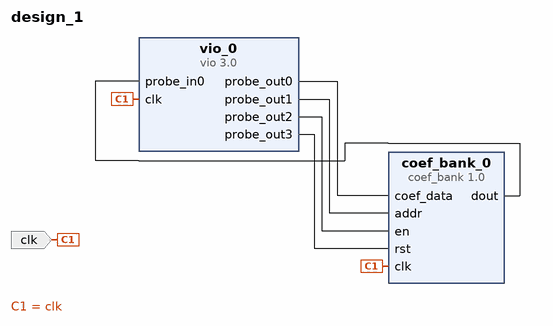
[diagram p0: block diagram of the top level]
# Vivado block design design_1, xc7a35tcpg236-1, Vivado 2019.1
create_bd_design design_1

create_bd_port -dir I -type clk clk
set_property -dict {CONFIG.FREQ_HZ 100000000} [get_bd_ports clk]

create_bd_cell -type ip -vlnv xilinx.com:ip:vio:3.0 vio_0
set_property -dict {CONFIG.C_NUM_PROBE_OUT 4 CONFIG.C_PROBE_OUT0_WIDTH 25 CONFIG.C_PROBE_OUT1_WIDTH 3} [get_bd_cells vio_0]
create_bd_cell -type ip -vlnv xilinx.com:user:coef_bank:1.0 coef_bank_0
set_property -dict {CONFIG.log2_nbr_coef 3 CONFIG.nbr_coef 8} [get_bd_cells coef_bank_0]

# ---- connections ----

connect_bd_net [get_bd_pins vio_0/probe_out0] [get_bd_pins coef_bank_0/coef_data]
connect_bd_net [get_bd_pins vio_0/probe_out1] [get_bd_pins coef_bank_0/addr]
connect_bd_net [get_bd_pins vio_0/probe_out2] [get_bd_pins coef_bank_0/en]
connect_bd_net [get_bd_pins vio_0/probe_out3] [get_bd_pins coef_bank_0/rst]
connect_bd_net [get_bd_ports clk] [get_bd_pins vio_0/clk] [get_bd_pins coef_bank_0/clk]
connect_bd_net [get_bd_pins coef_bank_0/dout] [get_bd_pins vio_0/probe_in0]

validate_bd_design
save_bd_design
